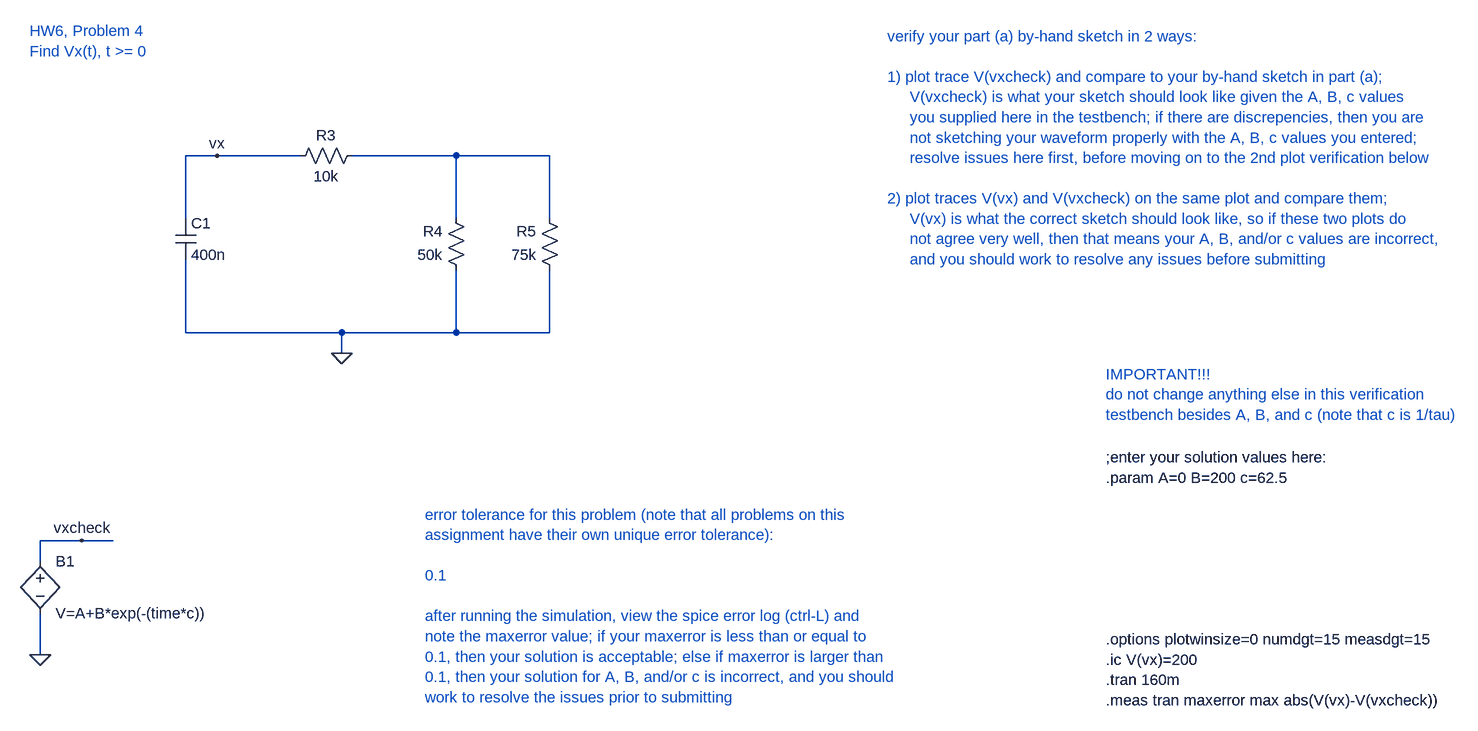
[diagram p0: schematic hw6_prob4.asc]
hw6_prob4.asc, the LTspice schematic file:
Version 4
SHEET 1 1436 1156
WIRE -528 -208 -576 -208
WIRE -400 -208 -528 -208
WIRE -160 -208 -320 -208
WIRE -16 -208 -160 -208
WIRE -576 -112 -576 -208
WIRE -160 -112 -160 -208
WIRE -16 -112 -16 -208
WIRE -576 64 -576 -48
WIRE -336 64 -576 64
WIRE -160 64 -160 -32
WIRE -160 64 -336 64
WIRE -16 64 -16 -32
WIRE -16 64 -160 64
WIRE -336 96 -336 64
WIRE -736 384 -800 384
WIRE -688 384 -736 384
WIRE -800 416 -800 384
WIRE -800 560 -800 496
FLAG -336 96 0
FLAG -528 -208 vx
FLAG -800 560 0
FLAG -736 384 vxcheck
SYMBOL res -304 -224 R90
WINDOW 0 0 56 VBottom 2
WINDOW 3 32 56 VTop 2
SYMATTR InstName R3
SYMATTR Value 10k
SYMBOL res -144 -16 R180
WINDOW 0 36 76 Left 2
WINDOW 3 36 40 Left 2
SYMATTR InstName R4
SYMATTR Value 50k
SYMBOL res 0 -16 R180
WINDOW 0 36 76 Left 2
WINDOW 3 36 40 Left 2
SYMATTR InstName R5
SYMATTR Value 75k
SYMBOL cap -592 -112 R0
SYMATTR InstName C1
SYMATTR Value 400n
SYMBOL bv -800 400 R0
SYMATTR InstName B1
SYMATTR Value V=A+B*exp(-(time*c))
TEXT 840 536 Left 2 !.options plotwinsize=0 numdgt=15 measdgt=15\n.ic V(vx)=200\n.tran 160m\n.meas tran maxerror max abs(V(vx)-V(vxcheck))
TEXT -816 -400 Left 2 ;HW6, Problem 4\nFind Vx(t), t >= 0
TEXT -208 344 Left 2 ;error tolerance for this problem (note that all problems on this \nassignment have their own unique error tolerance):\n \n0.1\n \nafter running the simulation, view the spice error log (ctrl-L) and \nnote the maxerror value; if your maxerror is less than or equal to\n0.1, then your solution is acceptable; else if maxerror is larger than\n0.1, then your solution for A, B, and/or c is incorrect, and you should \nwork to resolve the issues prior to submitting
TEXT 840 256 Left 2 !;enter your solution values here:\n.param A=0 B=200 c=62.5
TEXT 840 128 Left 2 ;IMPORTANT!!!\ndo not change anything else in this verification\ntestbench besides A, B, and c (note that c is 1/tau)
TEXT 504 -392 Left 2 ;verify your part (a) by-hand sketch in 2 ways:\n \n1) plot trace V(vxcheck) and compare to your by-hand sketch in part (a);\n     V(vxcheck) is what your sketch should look like given the A, B, c values \n     you supplied here in the testbench; if there are discrepencies, then you are\n     not sketching your waveform properly with the A, B, c values you entered;\n     resolve issues here first, before moving on to the 2nd plot verification below\n \n2) plot traces V(vx) and V(vxcheck) on the same plot and compare them;\n     V(vx) is what the correct sketch should look like, so if these two plots do \n     not agree very well, then that means your A, B, and/or c values are incorrect,\n     and you should work to resolve any issues before submitting

The netlist it stands for:
* hw6_prob4.asc
R3 N001 vx 10k
R4 0 N001 50k
R5 0 N001 75k
C1 vx 0 400n
B1 vxcheck 0 V=A+B*exp(-(time*c))
.options plotwinsize=0 numdgt=15 measdgt=15
.ic V(vx)=200
.tran 160m
.meas tran maxerror max abs(V(vx)-V(vxcheck))
* HW6, Problem 4
* Find Vx(t), t >= 0
* error tolerance for this problem (note that all problems on this
* assignment have their own unique error tolerance):
* 0.1
* after running the simulation, view the spice error log (ctrl-L) and
* note the maxerror value; if your maxerror is less than or equal to
* 0.1, then your solution is acceptable; else if maxerror is larger than
* 0.1, then your solution for A, B, and/or c is incorrect, and you should
* work to resolve the issues prior to submitting
;enter your solution values here:
.param A=0 B=200 c=62.5
* IMPORTANT!!!
* do not change anything else in this verification
* testbench besides A, B, and c (note that c is 1/tau)
* verify your part (a) by-hand sketch in 2 ways:
* 1) plot trace V(vxcheck) and compare to your by-hand sketch in part (a);
*      V(vxcheck) is what your sketch should look like given the A, B, c values
*      you supplied here in the testbench; if there are discrepencies, then you are
*      not sketching your waveform properly with the A, B, c values you entered;
*      resolve issues here first, before moving on to the 2nd plot verification below
* 2) plot traces V(vx) and V(vxcheck) on the same plot and compare them;
*      V(vx) is what the correct sketch should look like, so if these two plots do
*      not agree very well, then that means your A, B, and/or c values are incorrect,
*      and you should work to resolve any issues before submitting
.backanno
.end

* Results of the author's LTspice run, read from the files saved beside the schematic
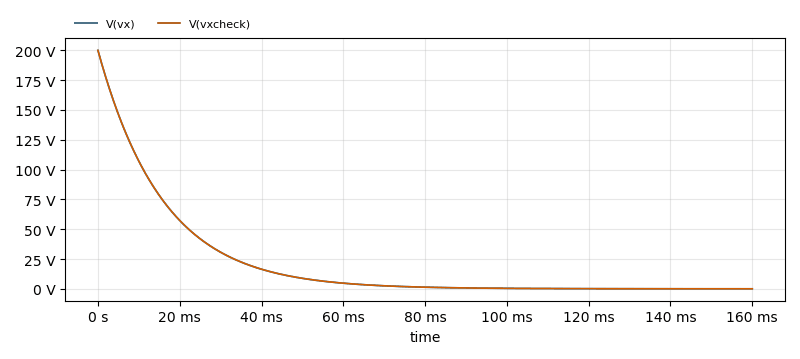
[diagram p1: Transient Analysis of hw6_prob4.asc, plotted from the saved traces]
* Transient Analysis, 1 run:
*   V(vx): min 9.08 mV, max 200 V, average 20 V, rms 44.72 V, last 9.08 mV
*   V(vxcheck): min 9.08 mV, max 200 V, average 20 V, rms 44.72 V, last 9.08 mV
* From the log:
*   maxerror: MAX(abs(v(vx)-v(vxcheck)))=0.0050673314236 FROM 0 TO 0.16